# EAGLE schematic LM3404 (EAGLE 6.5.0)
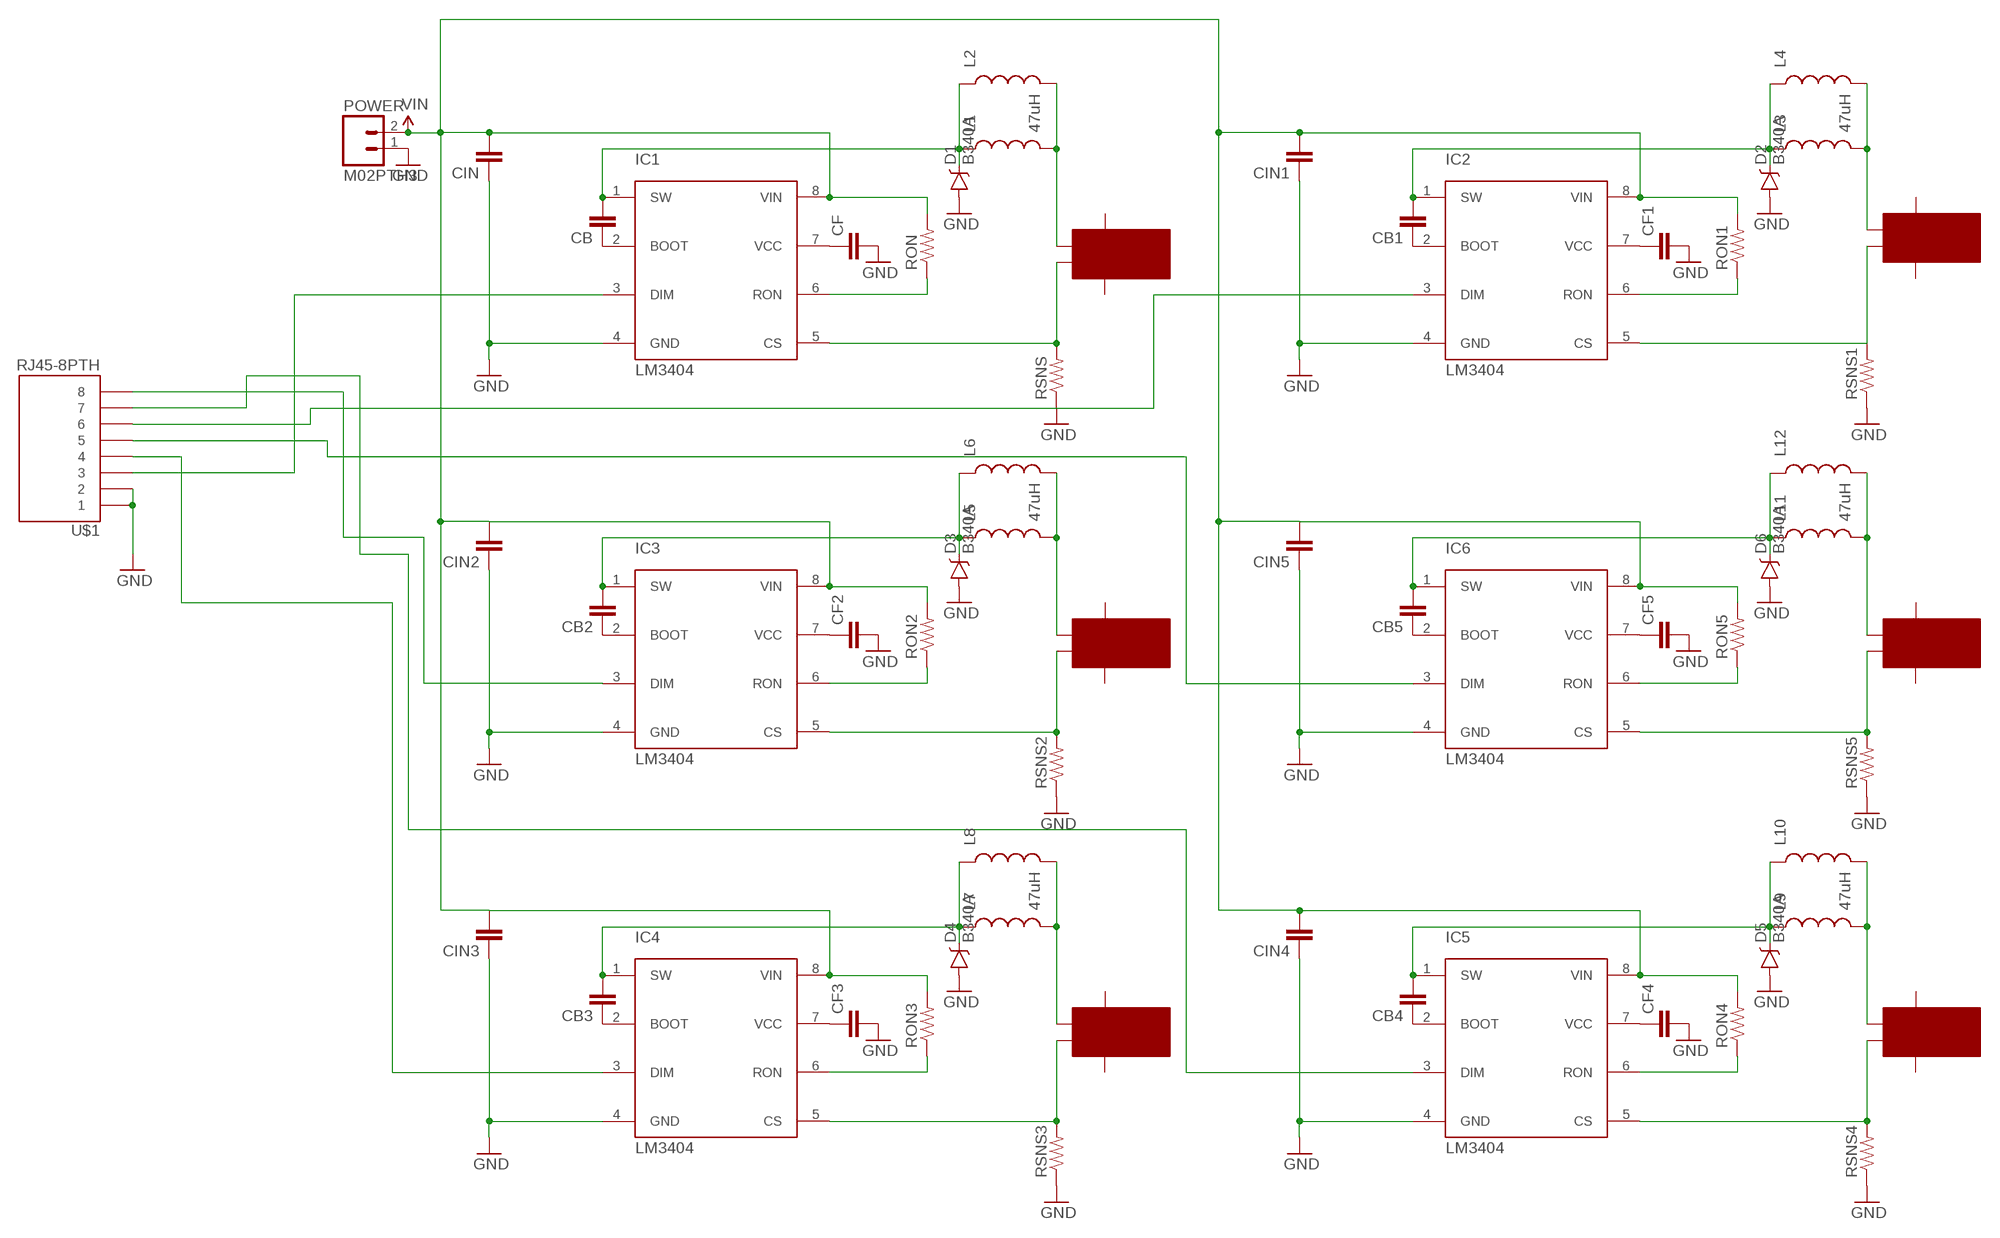
[diagram p0: schematic, sheet 1]

## Parts
CB  CAP1206  [1206]
CB1  CAP1206  [1206]
CB2  CAP1206  [1206]
CB3  CAP1206  [1206]
CB4  CAP1206  [1206]
CB5  CAP1206  [1206]
CF  CAP1206  [1206]
CF1  CAP1206  [1206]
CF2  CAP1206  [1206]
CF3  CAP1206  [1206]
CF4  CAP1206  [1206]
CF5  CAP1206  [1206]
CIN  CAP1206  [1206]
CIN1  CAP1206  [1206]
CIN2  CAP1206  [1206]
CIN3  CAP1206  [1206]
CIN4  CAP1206  [1206]
CIN5  CAP1206  [1206]
D1  B340A  DIODE-SCHOTTKY-B340A  [SMA-DIODE]
D2  B340A  DIODE-SCHOTTKY-B340A  [SMA-DIODE]
D3  B340A  DIODE-SCHOTTKY-B340A  [SMA-DIODE]
D4  B340A  DIODE-SCHOTTKY-B340A  [SMA-DIODE]
D5  B340A  DIODE-SCHOTTKY-B340A  [SMA-DIODE]
D6  B340A  DIODE-SCHOTTKY-B340A  [SMA-DIODE]
IC1  LM3404  [SO8]
IC2  LM3404  [SO8]
IC3  LM3404  [SO8]
IC4  LM3404  [SO8]
IC5  LM3404  [SO8]
IC6  LM3404  [SO8]
L1  47uH  INDUCTOR68UH-1A  [CR75]
L2  INDUCTORSDR1105  [B82462G]
L3  47uH  INDUCTOR68UH-1A  [CR75]
L4  INDUCTORSDR1105  [B82462G]
L5  47uH  INDUCTOR68UH-1A  [CR75]
L6  INDUCTORSDR1105  [B82462G]
L7  47uH  INDUCTOR68UH-1A  [CR75]
L8  INDUCTORSDR1105  [B82462G]
L9  47uH  INDUCTOR68UH-1A  [CR75]
L10  INDUCTORSDR1105  [B82462G]
L11  47uH  INDUCTOR68UH-1A  [CR75]
L12  INDUCTORSDR1105  [B82462G]
POWER  M02PTH3  [1X02_LONGPADS]
RON  RESISTOR1206  [1206]
RON1  RESISTOR1206  [1206]
RON2  RESISTOR1206  [1206]
RON3  RESISTOR1206  [1206]
RON4  RESISTOR1206  [1206]
RON5  RESISTOR1206  [1206]
RSNS  RESISTOR1206  [1206]
RSNS1  RESISTOR1206  [1206]
RSNS2  RESISTOR1206  [1206]
RSNS3  RESISTOR1206  [1206]
RSNS4  RESISTOR1206  [1206]
RSNS5  RESISTOR1206  [1206]
U$1  RJ45-8PTH  [RJ45-8]
U$2  RCA_JACK  [RCA_JACK]
U$3  RCA_JACK  [RCA_JACK]
U$4  RCA_JACK  [RCA_JACK]
U$5  RCA_JACK  [RCA_JACK]
U$6  RCA_JACK  [RCA_JACK]
U$7  RCA_JACK  [RCA_JACK]

## Nets
GND: CF1.2 CF2.2 CF3.2 CF4.2 CF5.2 CF.2 CIN1.1 CIN2.1 CIN3.1 CIN4.1 CIN5.1 CIN.1 D1.A D2.A D3.A D4.A D5.A D6.A IC1.4(GND) IC2.4(GND) IC3.4(GND) IC4.4(GND) IC5.4(GND) IC6.4(GND) POWER.1 RSNS1.1 RSNS2.1 RSNS3.1 RSNS4.1 RSNS5.1 RSNS.1 U$1.1 U$1.2
N$1: CF.1 IC1.7(VCC)
N$2: CB.1 IC1.2(BOOT)
N$3: IC2.3(DIM) U$1.6
N$4: CB.2 D1.C IC1.1(SW) L1.P$1 L2.P$1
N$5: IC1.5(CS) RSNS.2 U$7.INNER
N$6: IC1.6(RON) RON.1
N$7: CF1.1 IC2.7(VCC)
N$8: IC1.3(DIM) U$1.3
N$9: L1.P$2 L2.P$2 U$7.SIG
N$10: CB1.1 IC2.2(BOOT)
N$11: CB1.2 D2.C IC2.1(SW) L3.P$1 L4.P$1
N$12: IC2.6(RON) RON1.1
N$13: IC2.5(CS) RSNS1.2 U$2.INNER
N$14: L3.P$2 L4.P$2 U$2.SIG
N$15: IC3.3(DIM) U$1.8
N$16: CF2.1 IC3.7(VCC)
N$17: CB2.1 IC3.2(BOOT)
N$18: CB2.2 D3.C IC3.1(SW) L5.P$1 L6.P$1
N$19: IC3.6(RON) RON2.1
N$20: IC3.5(CS) RSNS2.2 U$6.INNER
N$21: L5.P$2 L6.P$2 U$6.SIG
N$22: IC4.3(DIM) U$1.4
N$23: CF3.1 IC4.7(VCC)
N$24: CB3.1 IC4.2(BOOT)
N$25: CB3.2 D4.C IC4.1(SW) L7.P$1 L8.P$1
N$26: IC4.6(RON) RON3.1
N$27: IC4.5(CS) RSNS3.2 U$5.INNER
N$28: L7.P$2 L8.P$2 U$5.SIG
N$29: IC5.3(DIM) U$1.7
N$30: CF4.1 IC5.7(VCC)
N$31: CB4.1 IC5.2(BOOT)
N$32: CB4.2 D5.C IC5.1(SW) L9.P$1 L10.P$1
N$33: IC5.6(RON) RON4.1
N$34: IC5.5(CS) RSNS4.2 U$4.INNER
N$35: L9.P$2 L10.P$2 U$4.SIG
N$36: IC6.3(DIM) U$1.5
N$37: CF5.1 IC6.7(VCC)
N$38: CB5.1 IC6.2(BOOT)
N$39: CB5.2 D6.C IC6.1(SW) L11.P$1 L12.P$1
N$40: IC6.6(RON) RON5.1
N$41: IC6.5(CS) RSNS5.2 U$3.INNER
N$42: L11.P$2 L12.P$2 U$3.SIG
VIN: CIN1.2 CIN2.2 CIN3.2 CIN4.2 CIN5.2 CIN.2 IC1.8(VIN) IC2.8(VIN) IC3.8(VIN) IC4.8(VIN) IC5.8(VIN) IC6.8(VIN) POWER.2 RON1.2 RON2.2 RON3.2 RON4.2 RON5.2 RON.2
Unconnected: U$2.SWA U$2.SWB U$3.SWA U$3.SWB U$4.SWA U$4.SWB U$5.SWA U$5.SWB U$6.SWA U$6.SWB U$7.SWA U$7.SWB

## Library data of the parts
CB CB1-CB5 CF CF1-CF5 CIN CIN1-CIN5 = SparkFun-Capacitors:CAP: Capacitor Standard 0603 ceramic capacitor, and 0.1" leaded capacitor.
D1-D6 = SparkFun-DiscreteSemi:DIODE-SCHOTTKY: Schottky diodes in SFE's production catalog BAT20J 1A 23V 0.62Vf RB751 120mA 40V 0.37Vf PMEG4005EJ 0.5A 40V 0.42Vf MBRA140 1A 40V 0.5Vf B340A 3A 40V SMA; PROD_ID: DIO-09886
IC1-IC6 = LM3404:LM3404
L1 L3 L5 L7 L9 L11 = SparkFun-Passives:INDUCTOR: Inductors Basic Inductor/Choke - 0603 and 1206. Footprints are not proven and vary greatly between part numbers. SRN6045- 33uH, 20% 1.4A SDR0403-560KL - 56uH, 10%, 500mA RMS/740mA peak; PROD_ID: NDUC-09739; VALUE: 68uH
L2 L4 L6 L8 L10 L12 = Michael-Passives:INDUCTOR: Inductors Basic Inductor/Choke - 0603 and 1206. Footprints are not proven and vary greatly between part numbers. SRN6045- 33uH, 20% 1.4A SDR0403-560KL - 56uH, 10%, 500mA RMS/740mA peak; TEST: test thsi
POWER = SparkFun-Connectors:M02: Standard 2-pin 0.1" header. Use with - straight break away headers ( PRT-00116) - right angle break away headers (PRT-00553) - swiss pins (PRT-00743) - machine pins (PRT-00117) - female headers (PRT-00115) Molex polarized connector foot print use with: PRT-08233 with associated crimp pins and housings. 2.54_SCREWTERM for use with PRT-10571. 3.5mm Screw Terminal footprints for PRT-08084 5mm Screw Terminal footprints for use with PRT-08432
RON RON1-RON5 RSNS RSNS1-RSNS5 = SparkFun-Resistors:RESISTOR: Resistor Basic schematic elements and footprints for 0603, 1206, and PTH resistors.
U$1 = SparkFun-Connectors:RJ45-8: RJ45 Jack Simple RJ45, 8-pin connection - connector for common Cat5, Cat5e, and Cat6 Ethernet cables. Footprint not yet proven in production. Connector sku is PRT-00643; Breakout PCB sku is BOB-00716.
U$2-U$7 = Michael-Passives:RCA_JACK